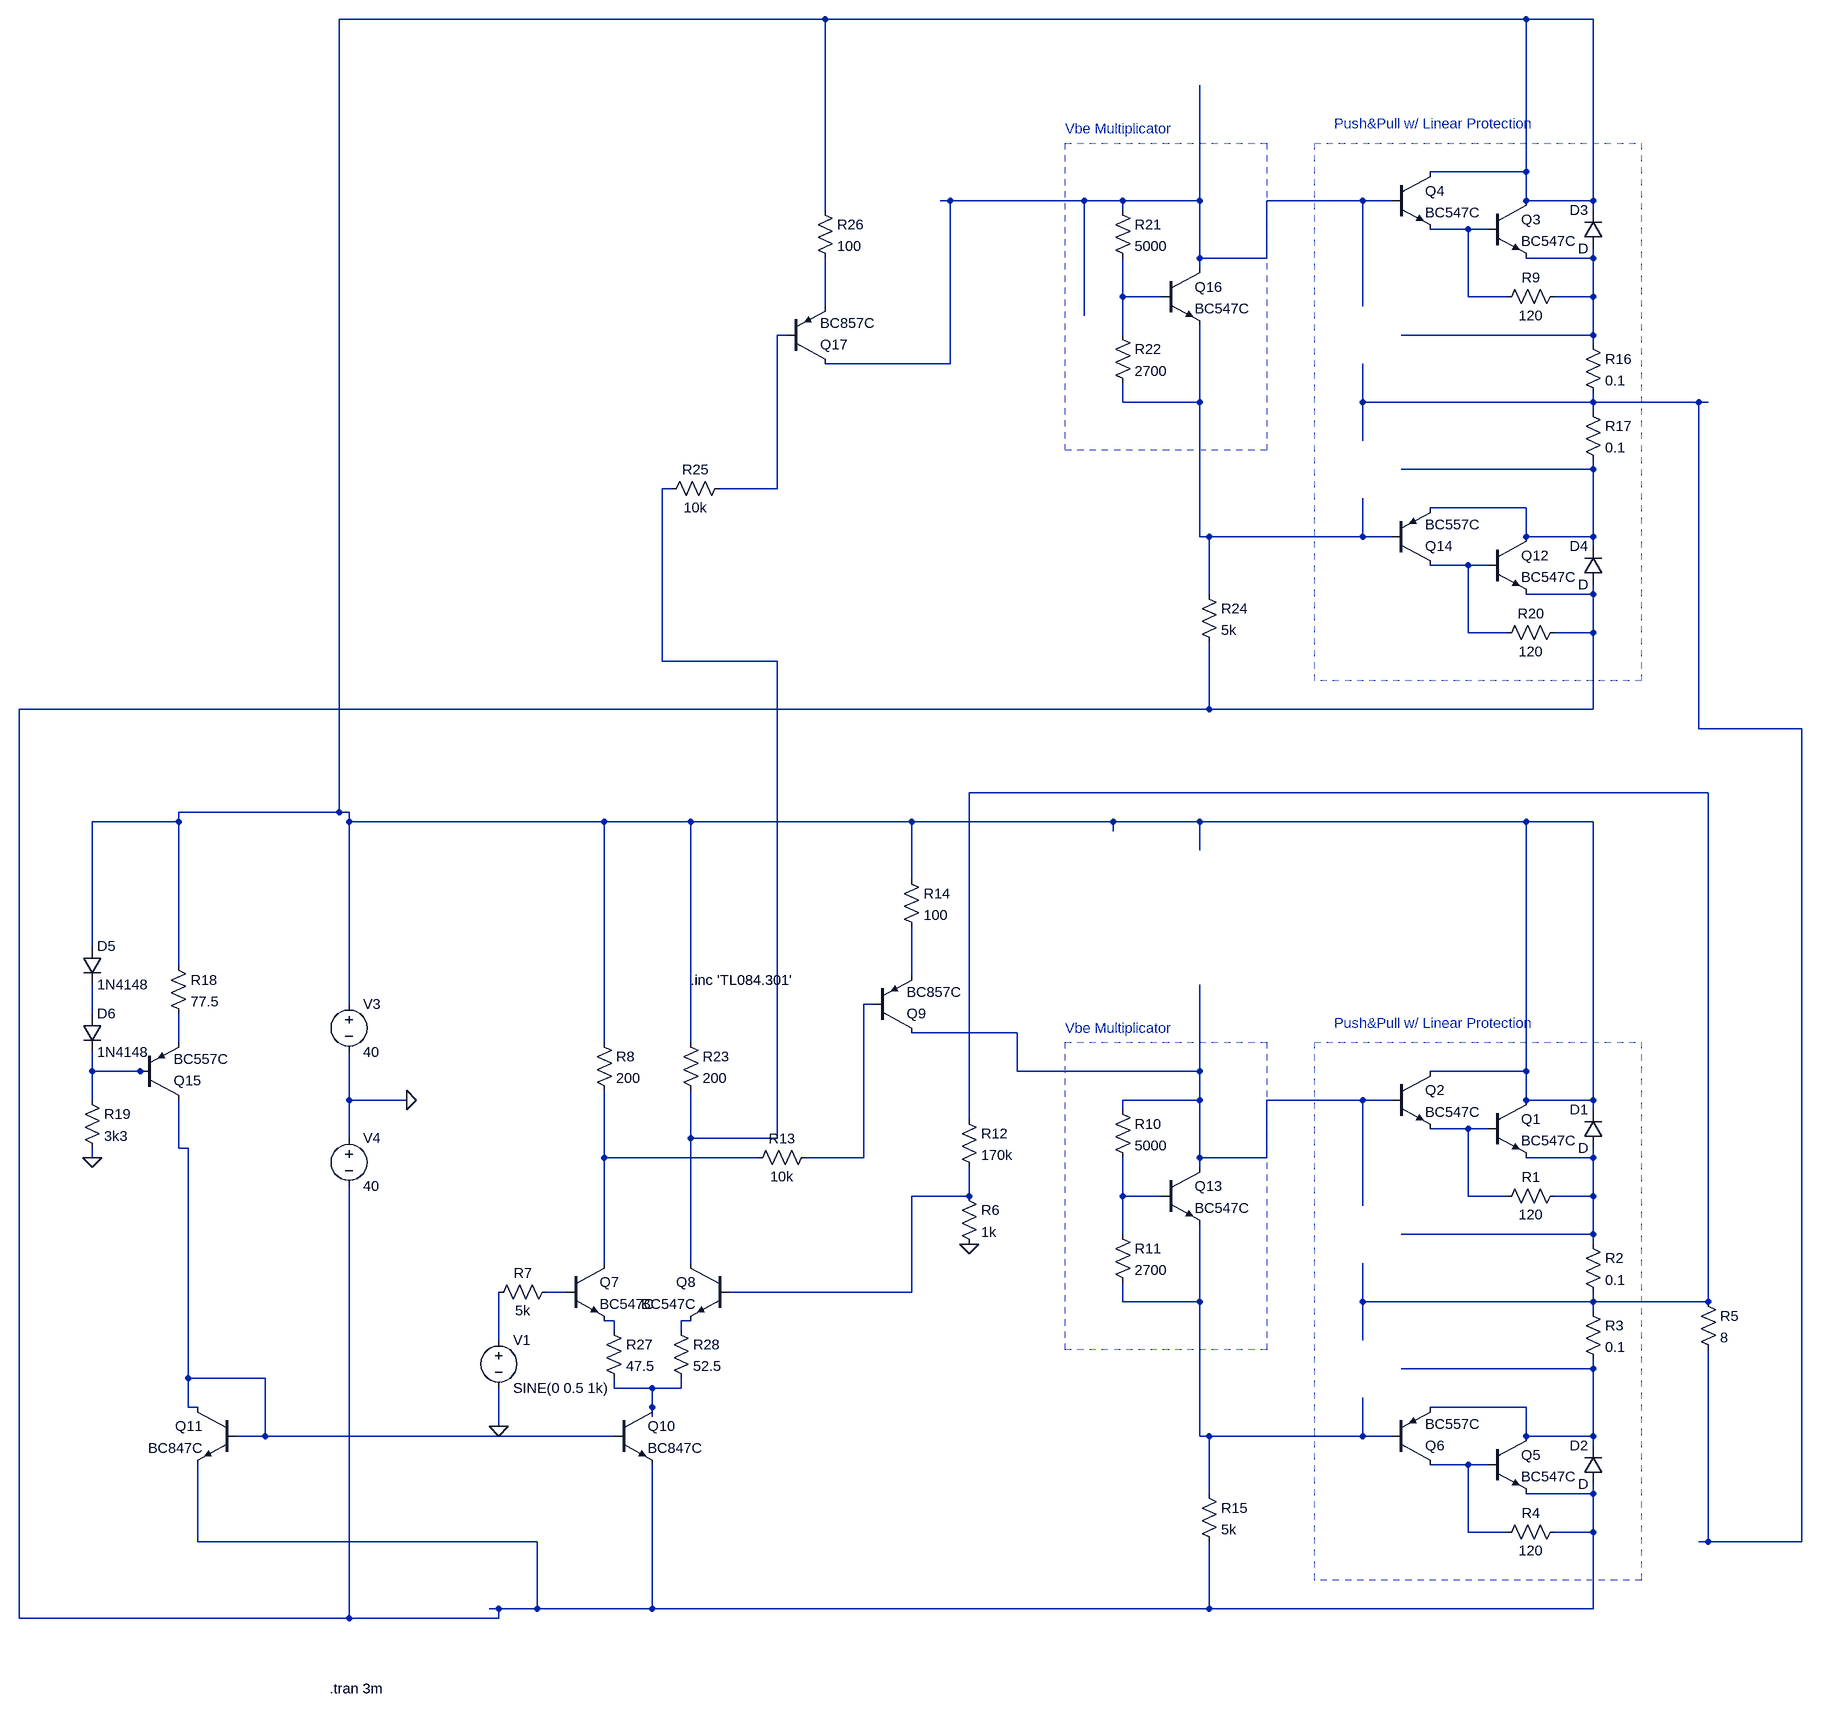
[diagram p0: schematic test.asc]
test.asc, the LTspice schematic file:
Version 4
SHEET 1 5552 2148
WIRE -1008 -1936 -1856 -1936
WIRE 160 -1936 -1008 -1936
WIRE 272 -1936 160 -1936
WIRE 160 -1520 160 -1936
WIRE 160 -1520 0 -1520
WIRE -800 -1472 -816 -1472
WIRE -576 -1472 -800 -1472
WIRE -512 -1472 -576 -1472
WIRE -384 -1472 -384 -1664
WIRE -384 -1472 -512 -1472
WIRE -112 -1472 -272 -1472
WIRE -64 -1472 -112 -1472
WIRE 160 -1472 160 -1520
WIRE 272 -1472 272 -1936
WIRE 272 -1472 160 -1472
WIRE -1008 -1456 -1008 -1936
WIRE -512 -1456 -512 -1472
WIRE 272 -1456 272 -1472
WIRE 64 -1424 0 -1424
WIRE 96 -1424 64 -1424
WIRE -384 -1376 -384 -1472
WIRE -272 -1376 -272 -1472
WIRE -272 -1376 -384 -1376
WIRE 272 -1376 272 -1392
WIRE 272 -1376 160 -1376
WIRE -384 -1360 -384 -1376
WIRE -512 -1312 -512 -1376
WIRE -448 -1312 -512 -1312
WIRE 64 -1312 64 -1424
WIRE 128 -1312 64 -1312
WIRE 272 -1312 272 -1376
WIRE 272 -1312 208 -1312
WIRE -1008 -1296 -1008 -1376
WIRE -112 -1296 -112 -1472
WIRE -576 -1280 -576 -1472
WIRE -1072 -1248 -1088 -1248
WIRE -512 -1248 -512 -1312
WIRE 272 -1248 272 -1312
WIRE 272 -1248 -48 -1248
WIRE 272 -1232 272 -1248
WIRE -800 -1200 -800 -1472
WIRE -800 -1200 -1008 -1200
WIRE -512 -1136 -512 -1168
WIRE -384 -1136 -384 -1264
WIRE -384 -1136 -512 -1136
WIRE -112 -1136 -112 -1200
WIRE 272 -1136 272 -1152
WIRE 272 -1136 -112 -1136
WIRE 448 -1136 272 -1136
WIRE 464 -1136 448 -1136
WIRE 272 -1120 272 -1136
WIRE -112 -1072 -112 -1136
WIRE 272 -1024 272 -1040
WIRE 272 -1024 -48 -1024
WIRE -1264 -992 -1280 -992
WIRE -1088 -992 -1088 -1248
WIRE -1088 -992 -1184 -992
WIRE 160 -960 0 -960
WIRE -384 -912 -384 -1136
WIRE -368 -912 -384 -912
WIRE -112 -912 -112 -976
WIRE -112 -912 -368 -912
WIRE -64 -912 -112 -912
WIRE 160 -912 160 -960
WIRE 272 -912 272 -1024
WIRE 272 -912 160 -912
WIRE 272 -896 272 -912
WIRE 64 -864 0 -864
WIRE 96 -864 64 -864
WIRE -368 -816 -368 -912
WIRE 272 -816 272 -832
WIRE 272 -816 160 -816
WIRE 64 -752 64 -864
WIRE 128 -752 64 -752
WIRE 272 -752 272 -816
WIRE 272 -752 208 -752
WIRE -1280 -704 -1280 -992
WIRE -1088 -704 -1280 -704
WIRE -368 -624 -368 -736
WIRE -368 -624 -2528 -624
WIRE 272 -624 272 -752
WIRE 272 -624 -368 -624
WIRE 448 -592 448 -1136
WIRE 928 -592 448 -592
WIRE 464 -480 -768 -480
WIRE -1856 -448 -1856 -1936
WIRE -1856 -448 -2144 -448
WIRE -1840 -448 -1856 -448
WIRE -2144 -432 -2144 -448
WIRE -2144 -432 -2288 -432
WIRE -1840 -432 -1840 -448
WIRE -1376 -432 -1840 -432
WIRE -1232 -432 -1376 -432
WIRE -864 -432 -1232 -432
WIRE -528 -432 -864 -432
WIRE -384 -432 -528 -432
WIRE 160 -432 -384 -432
WIRE 272 -432 160 -432
WIRE -528 -416 -528 -432
WIRE -384 -384 -384 -432
WIRE -864 -336 -864 -432
WIRE -2288 -224 -2288 -432
WIRE -2144 -192 -2144 -432
WIRE -864 -176 -864 -256
WIRE -1840 -128 -1840 -432
WIRE -928 -128 -944 -128
WIRE -2288 -112 -2288 -160
WIRE -688 -80 -864 -80
WIRE -2144 -64 -2144 -112
WIRE -1376 -64 -1376 -432
WIRE -1232 -64 -1232 -432
WIRE -2288 -16 -2288 -48
WIRE -2208 -16 -2288 -16
WIRE -2192 -16 -2208 -16
WIRE -688 -16 -688 -80
WIRE -384 -16 -384 -160
WIRE -384 -16 -688 -16
WIRE 160 -16 160 -432
WIRE 160 -16 0 -16
WIRE -2288 32 -2288 -16
WIRE -1840 32 -1840 -48
WIRE -1744 32 -1840 32
WIRE -384 32 -384 -16
WIRE -384 32 -512 32
WIRE -112 32 -272 32
WIRE -64 32 -112 32
WIRE 160 32 160 -16
WIRE 272 32 272 -432
WIRE 272 32 160 32
WIRE -512 48 -512 32
WIRE 272 48 272 32
WIRE -768 64 -768 -480
WIRE 64 80 0 80
WIRE 96 80 64 80
WIRE -1840 96 -1840 32
WIRE -1232 96 -1232 16
WIRE -1088 96 -1088 -704
WIRE -1088 96 -1232 96
WIRE -2144 112 -2144 32
WIRE -2128 112 -2144 112
WIRE -2288 128 -2288 112
WIRE -1376 128 -1376 16
WIRE -1120 128 -1376 128
WIRE -944 128 -944 -128
WIRE -944 128 -1040 128
WIRE -384 128 -384 32
WIRE -272 128 -272 32
WIRE -272 128 -384 128
WIRE 272 128 272 112
WIRE 272 128 160 128
WIRE -384 144 -384 128
WIRE -768 192 -768 144
WIRE -768 192 -864 192
WIRE -512 192 -512 128
WIRE -448 192 -512 192
WIRE 64 192 64 80
WIRE 128 192 64 192
WIRE 272 192 272 128
WIRE 272 192 208 192
WIRE -112 208 -112 32
WIRE -512 256 -512 192
WIRE 272 256 272 192
WIRE 272 256 -48 256
WIRE 272 272 272 256
WIRE -1376 304 -1376 128
WIRE -1232 304 -1232 96
WIRE -1440 352 -1472 352
WIRE -864 352 -864 192
WIRE -864 352 -1168 352
WIRE -512 368 -512 336
WIRE -384 368 -384 240
WIRE -384 368 -512 368
WIRE -112 368 -112 304
WIRE 272 368 272 352
WIRE 272 368 -112 368
WIRE 464 368 464 -480
WIRE 464 368 272 368
WIRE 272 384 272 368
WIRE -1360 400 -1376 400
WIRE -1232 400 -1248 400
WIRE -1360 416 -1360 400
WIRE -1248 416 -1248 400
WIRE -1552 432 -1552 352
WIRE -112 432 -112 368
WIRE 272 480 272 464
WIRE 272 480 -48 480
WIRE -2128 496 -2128 112
WIRE -2000 496 -2128 496
WIRE -1360 512 -1360 496
WIRE -1296 512 -1360 512
WIRE -1248 512 -1248 496
WIRE -1248 512 -1296 512
WIRE -2128 544 -2128 496
WIRE -2112 544 -2128 544
WIRE -1296 544 -1296 512
WIRE 160 544 0 544
WIRE -1296 560 -1296 544
WIRE -1552 576 -1552 512
WIRE -2000 592 -2000 496
WIRE -2000 592 -2048 592
WIRE -1360 592 -2000 592
WIRE -384 592 -384 368
WIRE -368 592 -384 592
WIRE -112 592 -112 528
WIRE -112 592 -368 592
WIRE -64 592 -112 592
WIRE 160 592 160 544
WIRE 272 592 272 480
WIRE 272 592 160 592
WIRE 272 608 272 592
WIRE 64 640 0 640
WIRE 96 640 64 640
WIRE -368 688 -368 592
WIRE 272 688 272 672
WIRE 272 688 160 688
WIRE 64 752 64 640
WIRE 128 752 64 752
WIRE 272 752 272 688
WIRE 272 752 208 752
WIRE -2112 768 -2112 640
WIRE -1488 768 -2112 768
WIRE 464 768 464 448
WIRE 464 768 448 768
WIRE 928 768 928 -592
WIRE 928 768 464 768
WIRE -1552 880 -1568 880
WIRE -1488 880 -1488 768
WIRE -1488 880 -1552 880
WIRE -1296 880 -1296 640
WIRE -1296 880 -1488 880
WIRE -368 880 -368 768
WIRE -368 880 -1296 880
WIRE 272 880 272 752
WIRE 272 880 -368 880
WIRE -2528 896 -2528 -624
WIRE -1840 896 -1840 176
WIRE -1840 896 -2528 896
WIRE -1552 896 -1552 880
WIRE -1552 896 -1840 896
FLAG -2288 128 0
FLAG -1744 32 0
FLAG -1552 576 0
FLAG -768 272 0
SYMBOL npn 96 32 R0
SYMATTR InstName Q1
SYMATTR Value BC547C
SYMBOL npn -64 -16 R0
SYMATTR InstName Q2
SYMATTR Value BC547C
SYMBOL res 224 176 R90
WINDOW 0 0 56 VBottom 2
WINDOW 3 32 56 VTop 2
SYMATTR InstName R1
SYMATTR Value 120
SYMBOL res 256 256 R0
SYMATTR InstName R2
SYMATTR Value 0.1
SYMBOL res 256 368 R0
SYMATTR InstName R3
SYMATTR Value 0.1
SYMBOL npn 96 592 R0
SYMATTR InstName Q5
SYMATTR Value BC547C
SYMBOL res 224 736 R90
WINDOW 0 0 56 VBottom 2
WINDOW 3 32 56 VTop 2
SYMATTR InstName R4
SYMATTR Value 120
SYMBOL pnp -64 640 M180
SYMATTR InstName Q6
SYMATTR Value BC557C
SYMBOL npn -448 144 R0
SYMATTR InstName Q13
SYMATTR Value BC547C
SYMBOL res -528 32 R0
SYMATTR InstName R10
SYMATTR Value 5000
SYMBOL res -528 240 R0
SYMATTR InstName R11
SYMATTR Value 2700
SYMBOL pnp -2208 32 M180
SYMATTR InstName Q15
SYMATTR Value BC557C
SYMBOL res -2160 -208 R0
SYMATTR InstName R18
SYMATTR Value 77.5
SYMBOL res -2304 16 R0
SYMATTR InstName R19
SYMATTR Value 3k3
SYMBOL diode -2304 -224 R0
SYMATTR InstName D5
SYMATTR Value 1N4148
SYMBOL diode -2304 -112 R0
SYMATTR InstName D6
SYMATTR Value 1N4148
SYMBOL res 448 352 R0
SYMATTR InstName R5
SYMATTR Value 8
SYMBOL voltage -1840 -144 R0
WINDOW 123 0 0 Left 0
WINDOW 39 0 0 Left 0
SYMATTR InstName V3
SYMATTR Value 40
SYMBOL voltage -1840 80 R0
WINDOW 123 0 0 Left 0
WINDOW 39 0 0 Left 0
SYMATTR InstName V4
SYMATTR Value 40
SYMBOL diode 288 112 R180
WINDOW 0 24 64 Left 2
WINDOW 3 24 0 Left 2
SYMATTR InstName D1
SYMBOL diode 288 672 R180
WINDOW 0 24 64 Left 2
WINDOW 3 24 0 Left 2
SYMATTR InstName D2
SYMBOL npn -1440 304 R0
SYMATTR InstName Q7
SYMATTR Value BC547C
SYMBOL npn -1168 304 M0
SYMATTR InstName Q8
SYMATTR Value BC547C
SYMBOL res -784 48 R0
SYMATTR InstName R12
SYMATTR Value 170k
SYMBOL res -1456 336 R90
WINDOW 0 0 56 VBottom 2
WINDOW 3 32 56 VTop 2
SYMATTR InstName R7
SYMATTR Value 5k
SYMBOL res -784 176 R0
SYMATTR InstName R6
SYMATTR Value 1k
SYMBOL res -1392 -80 R0
SYMATTR InstName R8
SYMATTR Value 200
SYMBOL pnp -928 -80 M180
SYMATTR InstName Q9
SYMATTR Value BC857C
SYMBOL res -1024 112 R90
WINDOW 0 0 56 VBottom 2
WINDOW 3 32 56 VTop 2
SYMATTR InstName R13
SYMATTR Value 10k
SYMBOL res -880 -352 R0
SYMATTR InstName R14
SYMATTR Value 100
SYMBOL res -384 672 R0
SYMATTR InstName R15
SYMATTR Value 5k
SYMBOL npn -1360 544 R0
SYMATTR InstName Q10
SYMATTR Value BC847C
SYMBOL npn -2048 544 M0
SYMATTR InstName Q11
SYMATTR Value BC847C
SYMBOL npn 96 -1472 R0
SYMATTR InstName Q3
SYMATTR Value BC547C
SYMBOL npn -64 -1520 R0
SYMATTR InstName Q4
SYMATTR Value BC547C
SYMBOL res 224 -1328 R90
WINDOW 0 0 56 VBottom 2
WINDOW 3 32 56 VTop 2
SYMATTR InstName R9
SYMATTR Value 120
SYMBOL res 256 -1248 R0
SYMATTR InstName R16
SYMATTR Value 0.1
SYMBOL res 256 -1136 R0
SYMATTR InstName R17
SYMATTR Value 0.1
SYMBOL npn 96 -912 R0
SYMATTR InstName Q12
SYMATTR Value BC547C
SYMBOL res 224 -768 R90
WINDOW 0 0 56 VBottom 2
WINDOW 3 32 56 VTop 2
SYMATTR InstName R20
SYMATTR Value 120
SYMBOL pnp -64 -864 M180
SYMATTR InstName Q14
SYMATTR Value BC557C
SYMBOL npn -448 -1360 R0
SYMATTR InstName Q16
SYMATTR Value BC547C
SYMBOL res -528 -1472 R0
SYMATTR InstName R21
SYMATTR Value 5000
SYMBOL res -528 -1264 R0
SYMATTR InstName R22
SYMATTR Value 2700
SYMBOL diode 288 -1392 R180
WINDOW 0 24 64 Left 2
WINDOW 3 24 0 Left 2
SYMATTR InstName D3
SYMBOL diode 288 -832 R180
WINDOW 0 24 64 Left 2
WINDOW 3 24 0 Left 2
SYMATTR InstName D4
SYMBOL res -384 -832 R0
SYMATTR InstName R24
SYMATTR Value 5k
SYMBOL res -1248 -80 R0
SYMATTR InstName R23
SYMATTR Value 200
SYMBOL pnp -1072 -1200 M180
SYMATTR InstName Q17
SYMATTR Value BC857C
SYMBOL res -1168 -1008 R90
WINDOW 0 0 56 VBottom 2
WINDOW 3 32 56 VTop 2
SYMATTR InstName R25
SYMATTR Value 10k
SYMBOL res -1024 -1472 R0
SYMATTR InstName R26
SYMATTR Value 100
SYMBOL res -1376 400 R0
SYMATTR InstName R27
SYMATTR Value 47.5
SYMBOL res -1264 400 R0
SYMATTR InstName R28
SYMATTR Value 52.5
SYMBOL voltage -1552 416 R0
WINDOW 123 0 0 Left 0
WINDOW 39 0 0 Left 0
SYMATTR InstName V1
SYMATTR Value SINE(0 0.5 1k)
TEXT -160 -96 Left 2 ;Push&Pull w/ Linear Protection
TEXT -608 -88 Left 2 ;Vbe Multiplicator
TEXT -1872 1048 Left 2 !.tran 3m
TEXT -1232 -168 Left 2 !.inc 'TL084.301'
TEXT -160 -1600 Left 2 ;Push&Pull w/ Linear Protection
TEXT -608 -1592 Left 2 ;Vbe Multiplicator
RECTANGLE Normal -272 448 -608 -64 2
RECTANGLE Normal 352 832 -192 -64 2
RECTANGLE Normal -272 -1056 -608 -1568 2
RECTANGLE Normal 352 -672 -192 -1568 2

The netlist it stands for:
* test.asc
Q1 N001 N021 N024 0 BC547C
Q2 N001 N018 N021 0 BC547C
R1 N024 N021 120
R2 N024 N014 0.1
R3 N014 N032 0.1
Q5 N032 N034 N013 0 BC547C
R4 N013 N034 120
Q6 N034 N028 N032 0 BC557C
Q13 N018 N026 N028 0 BC547C
R10 N018 N026 5000
R11 N026 N028 2700
Q15 N022 N020 N019 0 BC557C
R18 N001 N019 77.5
R19 N020 0 3k3
D5 N001 N017 1N4148
D6 N017 N020 1N4148
R5 N014 N009 8
V3 N001 0 40
V4 0 N013 40
D1 N024 N001 D
D2 N013 N032 D
Q7 N023 N027 N029 0 BC547C
Q8 N011 N025 N030 0 BC547C
R12 N014 N025 170k
R7 N027 N031 5k
R6 N025 0 1k
R8 N001 N023 200
Q9 N018 N016 N015 0 BC857C
R13 N016 N023 10k
R14 N001 N015 100
R15 N028 N013 5k
Q10 N033 N022 N013 0 BC847C
Q11 N022 N022 N013 0 BC847C
Q3 N001 N003 N004 0 BC547C
Q4 N001 N002 N003 0 BC547C
R9 N004 N003 120
R16 N004 N009 0.1
R17 N009 N010 0.1
Q12 N010 N012 N013 0 BC547C
R20 N013 N012 120
Q14 N012 N008 N010 0 BC557C
Q16 N002 N005 N008 0 BC547C
R21 N002 N005 5000
R22 N005 N008 2700
D3 N004 N001 D
D4 N013 N010 D
R24 N008 N013 5k
R23 N001 N011 200
Q17 N002 N007 N006 0 BC857C
R25 N007 N011 10k
R26 N001 N006 100
R27 N029 N033 47.5
R28 N030 N033 52.5
V1 N031 0 SINE(0 0.5 1k)
.model D D
.lib standard.dio
.model NPN NPN
.model PNP PNP
.lib standard.bjt
* Push&Pull w/ Linear Protection
* Vbe Multiplicator
.tran 3m
.inc 'TL084.301'
* Push&Pull w/ Linear Protection
* Vbe Multiplicator
.backanno
.end